# EasyEDA schematic EASY_EDA_File.json
TITLE: Sheet_1; REV: 1.0; Date: 2025-03-30; Sheet: 1/1; Drawn By: OM; Company: Your Company
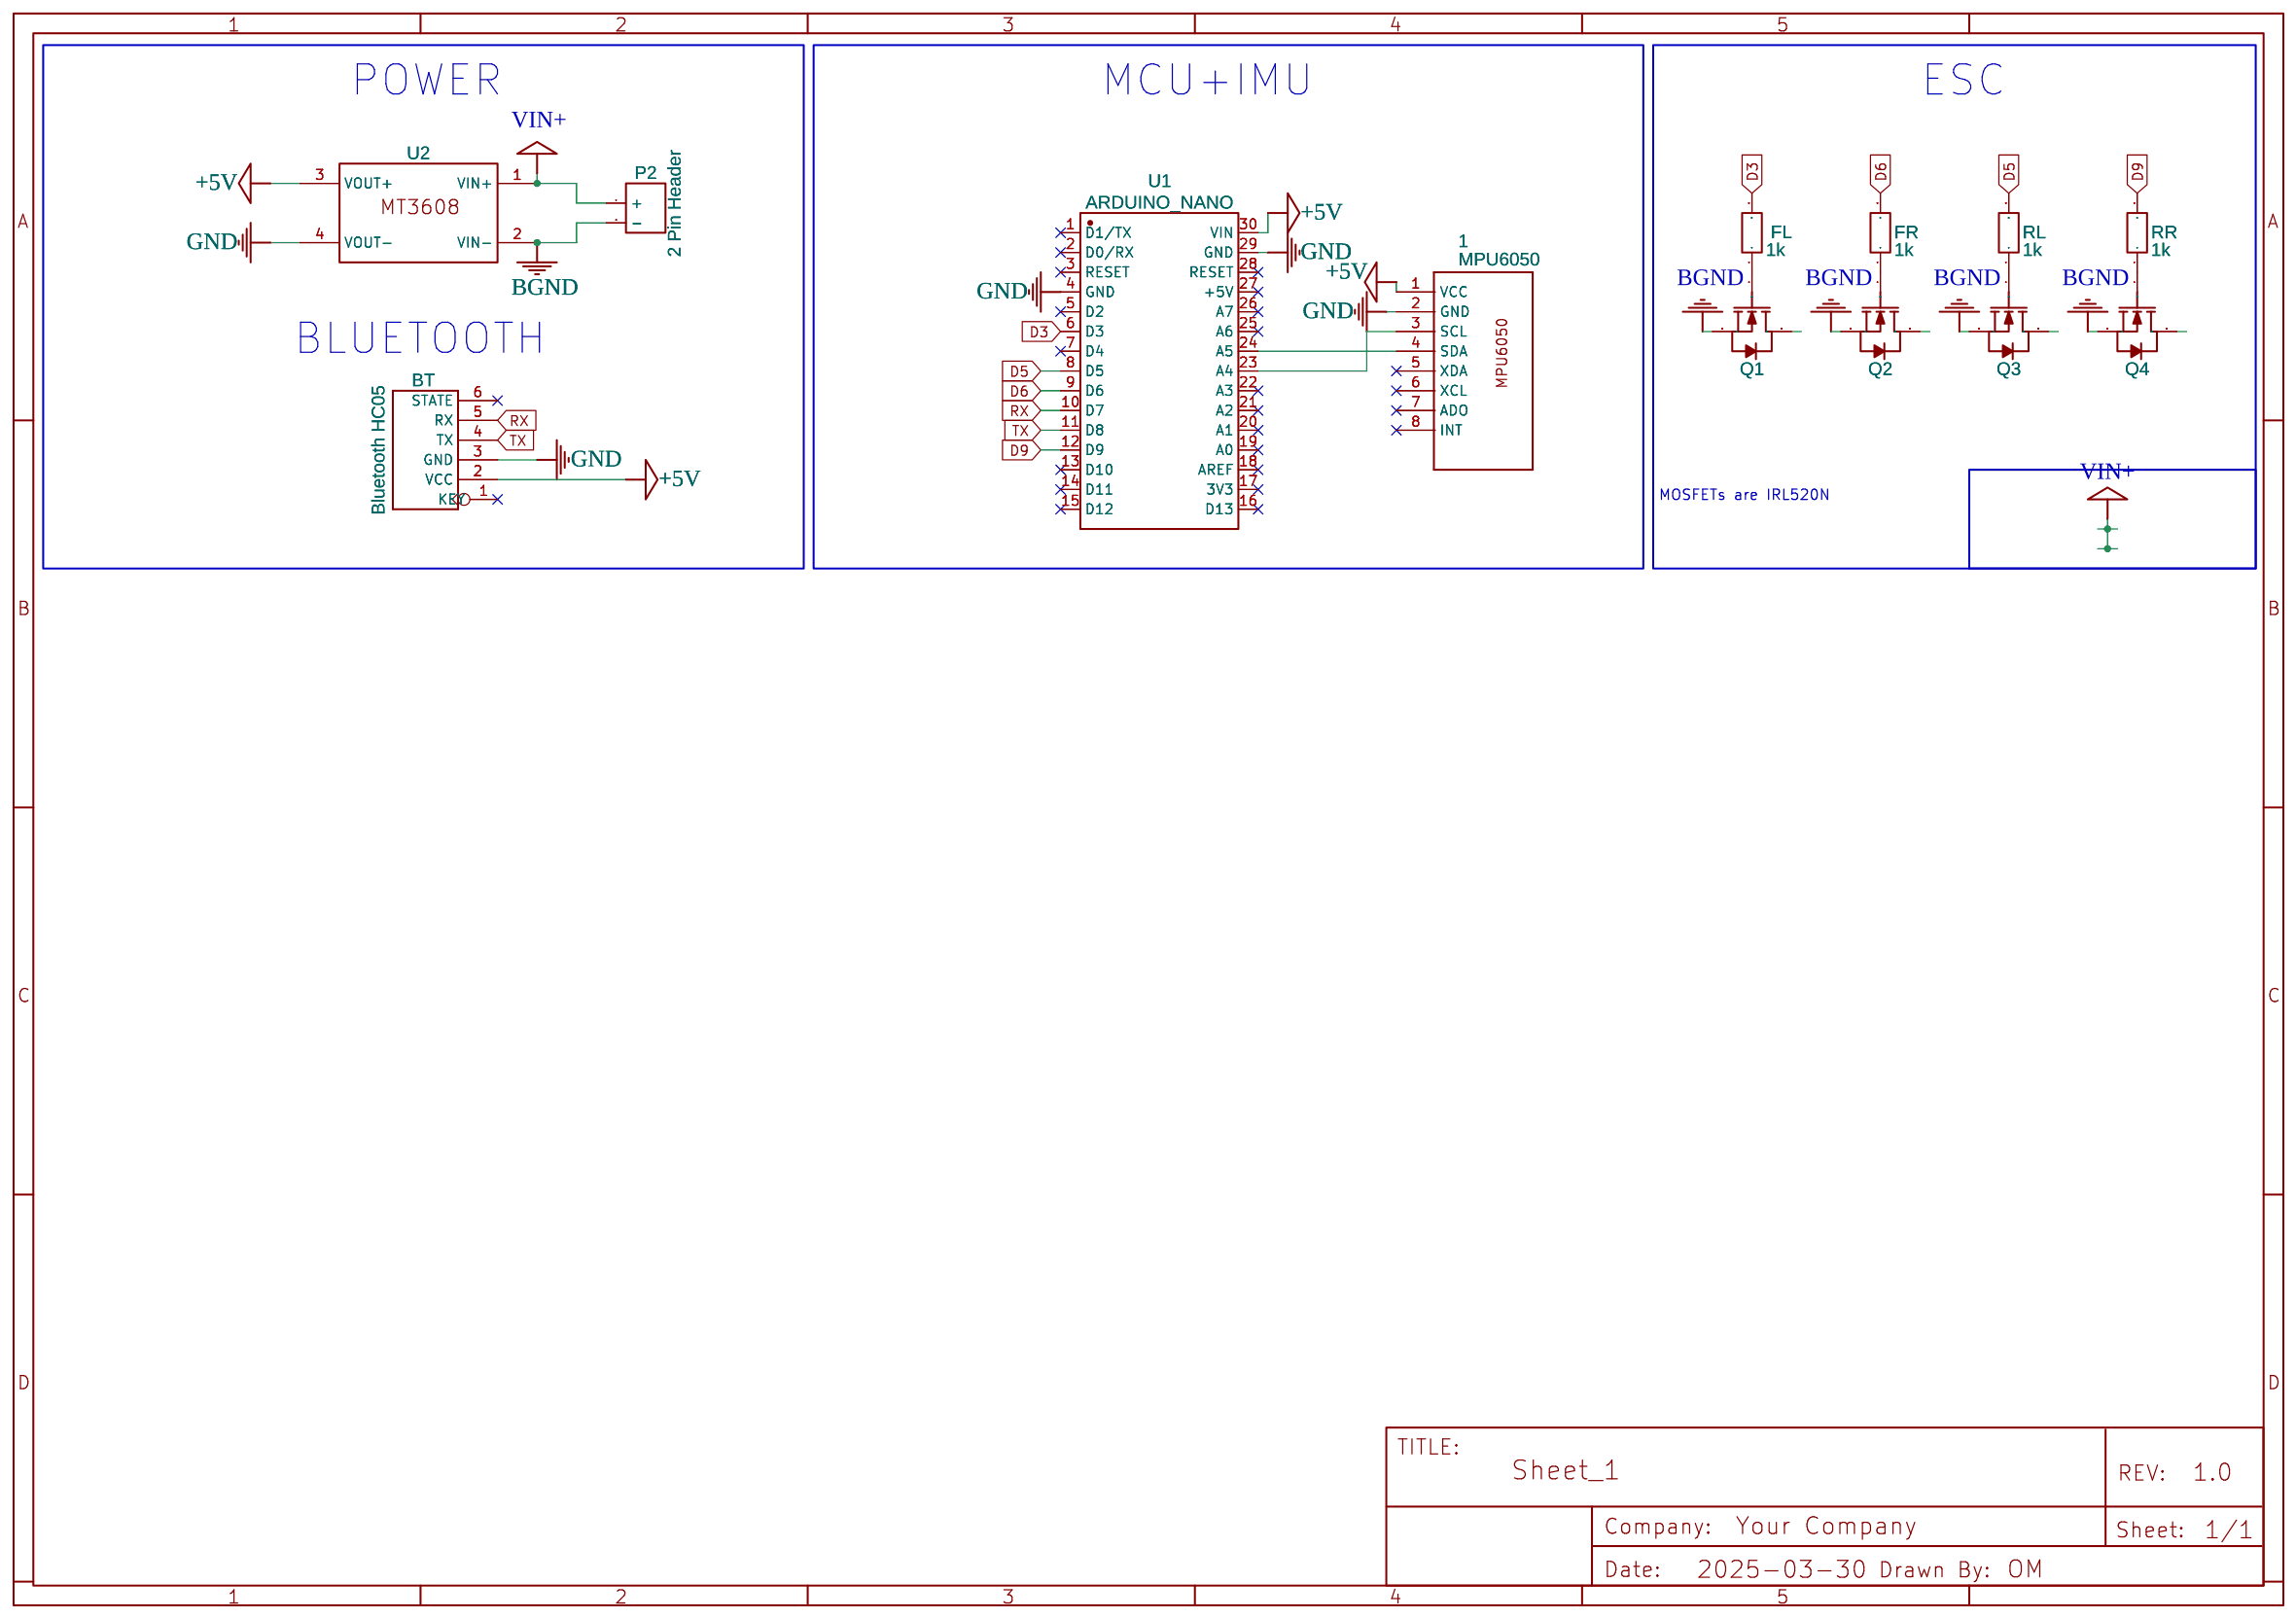
[diagram p0: schematic sheet]

## Parts
1  MPU6050  [MPU6050]
BT  Bluetooth HC05  [BLUETOOTH_HC05]
FL  1k  [R1206]
FR  1k  [R1206]
P2  2 Pin Header  [CONNECTOR_PINHEADER_2.54MM:PINHEADER_1X11_P_2.54MM]
Q1  IRL520NPBF  [TO-220AB-3_L10.4-W4.5-P2.54-L]
Q2  IRL520NPBF  [TO-220AB-3_L10.4-W4.5-P2.54-L]
Q3  IRL520NPBF  [TO-220AB-3_L10.4-W4.5-P2.54-L]
Q4  IRL520NPBF  [TO-220AB-3_L10.4-W4.5-P2.54-L]
RL  1k  [R1206]
RR  1k  [R1206]
U1  ARDUINO_NANO  [COMM-TH_ARDUINO_NANO]
U2  MT3608  [MT3608BOARD]

## Library data of the parts
1 = MPU6050: Contributor: PetrSimonik
BT = Bluetooth HC05: Contributor: otanezlor
FL FR RL RR = R_1206_EU: Contributor: LCEDA_Lib
P2 = HEADER PAD 2X: Supplier: LCSC; Manufacturer: BOOMELE; Manufacturer Part: Female headerHDR1X8-2.54; Supplier Part: C27438; JLCPCB Part Class: Extended Part; Contributor: merrittcvds
Q1-Q4 = IRL520NPBF: Contributor: LCSC; Supplier: LCSC; Supplier Part: C538129; Manufacturer: Infineon(英飞凌); JLCPCB Part Class: Extended Part
U1 = ARDUINO_NANO: Contributor: lcsc; Supplier: LCSC; Supplier Part: C9900017879; Manufacturer: null; JLCPCB Part Class: Extended Part
U2 = MT3608BOARD: Contributor: joker.0656

## Nets
+5V: 1.1(VCC) BT.2(VCC) U1.30(VIN) U2.3(VOUT+)
GND: 1.2(GND) BT.3(GND) U1.4(GND) U1.29(GND) U2.4(VOUT-)
VIN+: P2.1(+) U2.1(VIN+)
BGND: P2.2(-) Q1.3(S) Q2.3(S) Q3.3(S) Q4.3(S) U2.2(VIN-)
D3: FL.2 U1.6(D3)
D5: RL.2 U1.8(D5)
D6: FR.2 U1.9(D6)
D9: RR.2 U1.12(D9)
RX: BT.5(RX) U1.10(D7)
TX: BT.4(TX) U1.11(D8)
Net-(1-3): 1.3(SCL) U1.23(A4)
Net-(1-4): 1.4(SDA) U1.24(A5)
Net-(FL-1): FL.1 Q1.1(G)
Net-(FR-1): FR.1 Q2.1(G)
Net-(Q3-1): Q3.1(G) RL.1
Net-(Q4-1): Q4.1(G) RR.1

Not connected (* = marked no-connect by the designer): 1 5(XDA)* 6(XCL)* 7(ADO)* 8(INT)*; BT 1(KEY)* 6(STATE)*; Q1 2(D); Q2 2(D); Q3 2(D); Q4 2(D); U1 1(D1/TX)* 2(D0/RX)* 3(RESET)* 5(D2)* 7(D4)* 13(D10)* 14(D11)* 15(D12)* 16(D13)* 17(3V3)* 18(AREF)* 19(A0)* 20(A1)* 21(A2)* 22(A3)* 25(A6)* 26(A7)* 27(+5V)* 28(RESET)*

## Notes on the sheet
- POWER
- MCU+IMU
- ESC
- BLUETOOTH
- MOSFETs are IRL520N
